# Altium schematic sheet FINAL.SchDoc
size A2
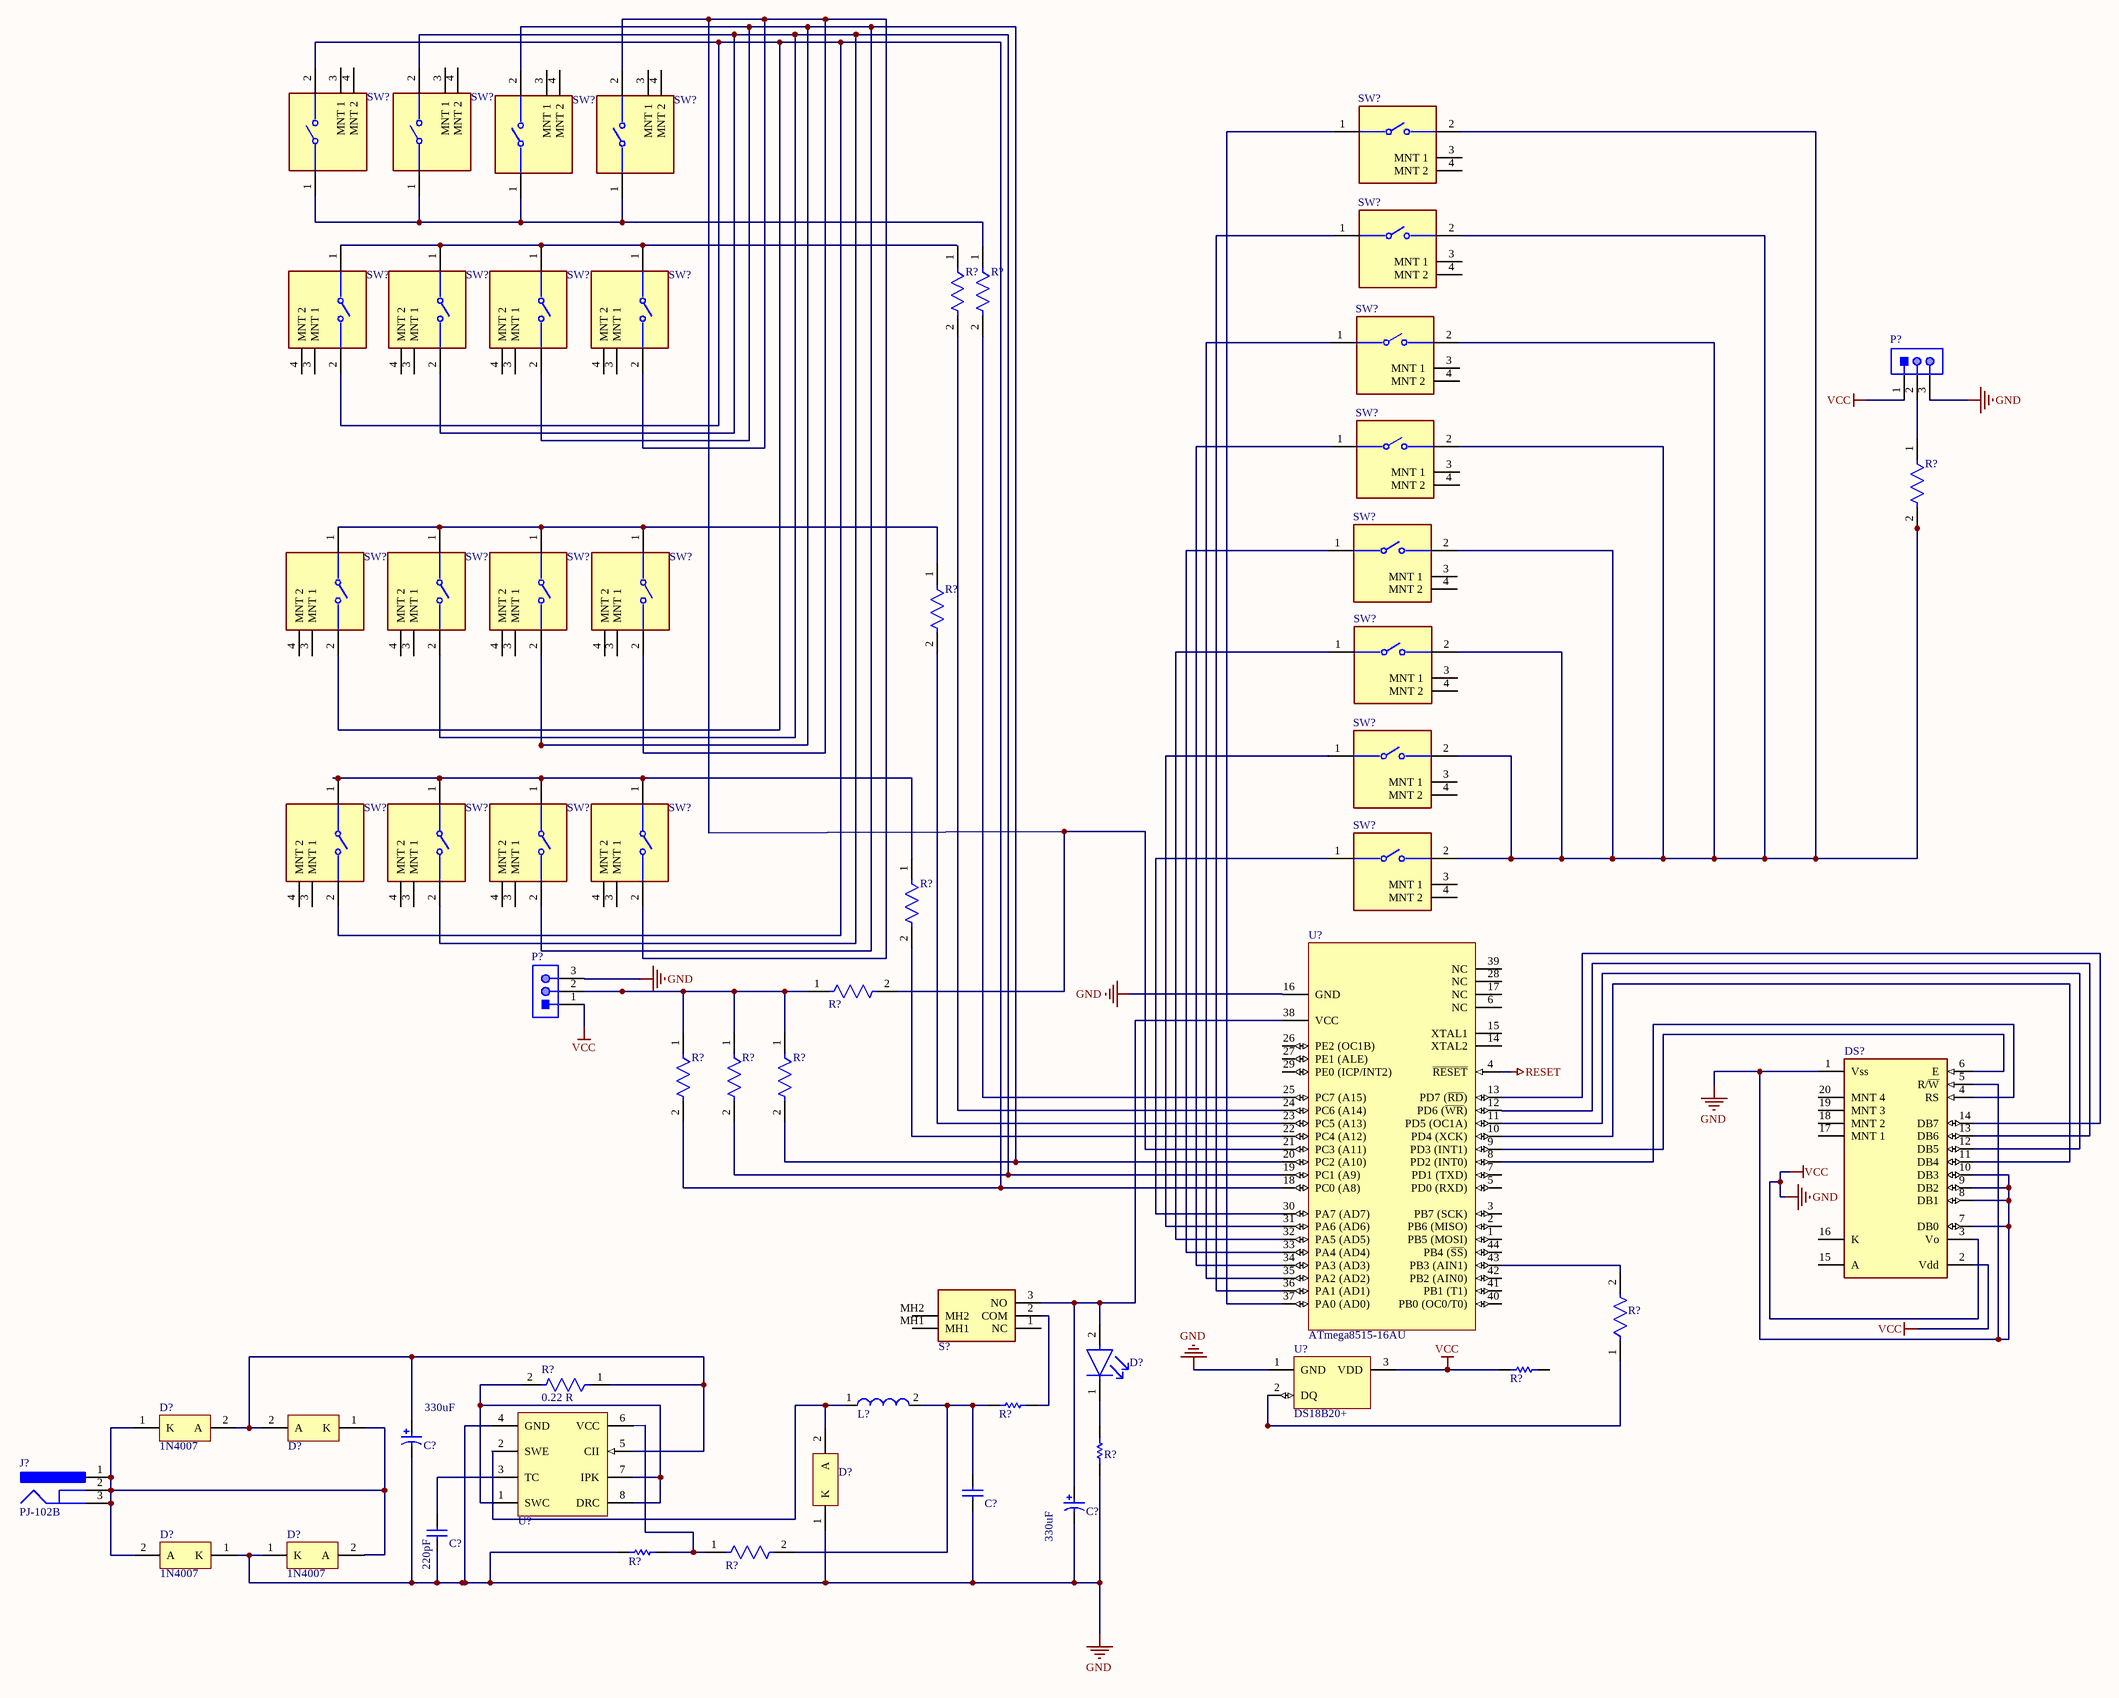
[diagram p0: FINAL.SchDoc]

## Parts
(Parts that share a designator on the sheet are numbered #1, #2 ... from top to bottom, then left to right.)
C?#1  EEE-FK1V331P  [PNSC-EEE-FK1V331P_L]  (value not drawn)
C?#2  EEE-FK1V331P  [PNSC-EEE-FK1V331P_L]  (value not drawn)
C?#3  GRM188R60J106ME47D  [CAPC1608X90X35NL10T15]  (value not drawn)
C?#4  VJ0603D201KXAAJ  [CAPC1608X92X38LL15T08]  (value not drawn)
D?#1  LTST-C190GKT  [FP-LTST-C190GKT-MFG]  (value not drawn)
D?#2  1N4007  [ONSC-AXIAL_LEAD-2-59-10_P]  (value not drawn)
D?#3  1N4007  [ONSC-AXIAL_LEAD-2-59-10_P]
D?#4  MBRS140T3G  [ONSC-SMB-2-403A-03_H_V]  (value not drawn)
D?#5  1N4007  [ONSC-AXIAL_LEAD-2-59-10_P]
D?#6  1N4007  [ONSC-AXIAL_LEAD-2-59-10_P]
DS?  WH1604A-YYH-JT#  [FP-WH1604A-YYH-JT#-MFG]  (value not drawn)
J?  PJ-102B  [CUI-PJ-102B_V]
L?  744774222  [WE-PD2-M]  (value not drawn)
P?#1  691701350003B  [691701350003B]  (value not drawn)
P?#2  691701350003B  [691701350003B]  (value not drawn)
R?#1  CRCW06031K00FKEAHP  [FP-CRCW0603-HPe3-MFG]  (value not drawn)
R?#2  CRCW06031K00FKEAHP  [FP-CRCW0603-HPe3-MFG]  (value not drawn)
R?#3  CRCW06031K00FKEAHP  [FP-CRCW0603-HPe3-MFG]  (value not drawn)
R?#4  CRCW06031K00FKEAHP  [FP-CRCW0603-HPe3-MFG]  (value not drawn)
R?#5  CRCW06031K00FKEAHP  [FP-CRCW0603-HPe3-MFG]  (value not drawn)
R?#6  CRCW06031K00FKEAHP  [FP-CRCW0603-HPe3-MFG]  (value not drawn)
R?#7  CRCW06031K00FKEAHP  [FP-CRCW0603-HPe3-MFG]  (value not drawn)
R?#8  CRCW06031K00FKEAHP  [FP-CRCW0603-HPe3-MFG]  (value not drawn)
R?#9  CRCW06031K00FKEAHP  [FP-CRCW0603-HPe3-MFG]  (value not drawn)
R?#10  CRCW08051K00FKEA  [RESC2013X50X30NL20T20]  (value not drawn)
R?#11  CRCW08050000Z0EAHP  [FP-CRCW0805-HPe3-IPC_A]  (value not drawn)
R?#12  Resistance: 0.22 R  [FP-CRCW0402-e3-IPC_C]  (hidden comment: CRCW04022K70FKED)
R?#13  Jumper 2512(6432)  [RESC2512(6432)_L]  (value not drawn)
R?#14  RC0402FR-072K2L  [RESC1005X40X25NL05T10]  (value not drawn)
R?#15  CRCW08051K00FKEA  [RESC2013X50X30NL20T20]  (value not drawn)
R?#16  CRCW06033K00FKEA  [FP-CRCW0603-e3-MFG]  (value not drawn)
S?  MS12ASW40  [MS12ASW40]  (value not drawn)
SW?#1  1825027-5  [FP-1825027-5-0]  (value not drawn)
SW?#2  1825027-5  [FP-1825027-5-0]  (value not drawn)
SW?#3  1825027-5  [FP-1825027-5-0]  (value not drawn)
SW?#4  1825027-5  [FP-1825027-5-0]  (value not drawn)
SW?#5  1825027-5  [FP-1825027-5-0]  (value not drawn)
SW?#6  1825027-5  [FP-1825027-5-0]  (value not drawn)
SW?#7  1825027-5  [FP-1825027-5-0]  (value not drawn)
SW?#8  1825027-5  [FP-1825027-5-0]  (value not drawn)
SW?#9  1825027-5  [FP-1825027-5-0]  (value not drawn)
SW?#10  1825027-5  [FP-1825027-5-0]  (value not drawn)
SW?#11  1825027-5  [FP-1825027-5-0]  (value not drawn)
SW?#12  1825027-5  [FP-1825027-5-0]  (value not drawn)
SW?#13  1825027-5  [FP-1825027-5-0]  (value not drawn)
SW?#14  1825027-5  [FP-1825027-5-0]  (value not drawn)
SW?#15  1825027-5  [FP-1825027-5-0]  (value not drawn)
SW?#16  1825027-5  [FP-1825027-5-0]  (value not drawn)
SW?#17  1825027-5  [FP-1825027-5-0]  (value not drawn)
SW?#18  1825027-5  [FP-1825027-5-0]  (value not drawn)
SW?#19  1825027-5  [FP-1825027-5-0]  (value not drawn)
SW?#20  1825027-5  [FP-1825027-5-0]  (value not drawn)
SW?#21  1825027-5  [FP-1825027-5-0]  (value not drawn)
SW?#22  1825027-5  [FP-1825027-5-0]  (value not drawn)
SW?#23  1825027-5  [FP-1825027-5-0]  (value not drawn)
SW?#24  1825027-5  [FP-1825027-5-0]  (value not drawn)
U?#1  ATmega8515-16AU  [44A_N]
U?#2  DS18B20+  [Q3+1]
U?#3  MC34063ACD-TR  [SO8_M]  (value not drawn)

## Nets
GND: C?#1.2 C?#2.2 C?#3.1 C?#4.1 D?#4.1(K) D?#5.1(K) D?#6.1(K) DS?.1(Vss) DS?.2(Vdd) DS?.3(Vo) DS?.5(R/~{W}) DS?.7(DB0) DS?.8(DB1) DS?.9(DB2) DS?.10(DB3) P?#1.1 P?#1.3 P?#2.1 P?#2.3 R?#10.1 R?#14.2 R?#15.1 U?#1.16(GND) U?#2.1(GND) U?#2.3(VDD) U?#3.4(GND)  [also labelled VCC]
RESET: U?#1.4(~{RESET})
NetC?#1_1: C?#1.1 D?#2.2(A) D?#3.2(A) R?#12.1 U?#3.5(CII)
NetC?#2_1: C?#2.1 D?#1.2(A) S?.3(NO) U?#1.38(VCC)
NetC?#3_2: C?#3.2 L?.2 R?#13.1 R?#16.2
NetC?#4_2: C?#4.2 U?#3.3(TC)
NetD?#1_1: D?#1.1(C) R?#14.1
NetD?#2_1: D?#2.1(K) D?#3.1(K) D?#5.2(A) J?.1 J?.2 J?.3
NetD?#4_2: D?#4.2(A) L?.1 U?#3.2(SWE)
NetDS?_4: DS?.4(RS) U?#1.8(PD2_(INT0))
NetDS?_6: DS?.6(E) U?#1.9(PD3_(INT1))
NetDS?_11: DS?.11(DB4) U?#1.10(PD4_(XCK))
NetDS?_12: DS?.12(DB5) U?#1.11(PD5_(OC1A))
NetDS?_13: DS?.13(DB6) U?#1.12(PD6_(~{WR}))
NetDS?_14: DS?.14(DB7) U?#1.13(PD7_(~{RD}))
NetP?#1_2: P?#1.2 R?#3.1
NetP?#2_2: P?#2.2 R?#6.1 R?#7.1 R?#8.1 R?#9.1
NetR?#1_1: R?#1.1 SW?#7.1 SW?#8.1 SW?#9.1 SW?#10.1
NetR?#1_2: R?#1.2 U?#1.24(PC6_(A14))
NetR?#2_1: R?#2.1 SW?#2.1 SW?#3.1 SW?#4.1 SW?#5.1
NetR?#2_2: R?#2.2 U?#1.25(PC7_(A15))
NetR?#3_2: R?#3.2 SW?#1.2 SW?#6.2 SW?#11.2 SW?#12.2 SW?#17.2 SW?#18.2 SW?#19.2 SW?#24.2
NetR?#4_1: R?#4.1 SW?#13.1 SW?#14.1 SW?#15.1 SW?#16.1
NetR?#4_2: R?#4.2 U?#1.23(PC5_(A13))
NetR?#5_1: R?#5.1 SW?#20.1 SW?#21.1 SW?#22.1 SW?#23.1
NetR?#5_2: R?#5.2 U?#1.22(PC4_(A12))
NetR?#6_2: R?#6.2 SW?#5.2 SW?#10.2 SW?#16.2 SW?#23.2 U?#1.21(PC3_(A11))
NetR?#7_2: R?#7.2 SW?#2.2 SW?#7.2 SW?#13.2 SW?#20.2 U?#1.18(PC0_(A8))
NetR?#8_2: R?#8.2 SW?#3.2 SW?#8.2 SW?#14.2 SW?#21.2 U?#1.19(PC1_(A9))
NetR?#9_2: R?#9.2 SW?#4.2 SW?#9.2 SW?#15.2 SW?#22.2 U?#1.20(PC2_(A10))
NetR?#11_1: R?#11.1 U?#2.2(DQ)
NetR?#11_2: R?#11.2 U?#1.43(PB3_(AIN1))
NetR?#12_2: R?#12.2 U?#3.1(SWC) U?#3.7(IPK) U?#3.8(DRC)
NetR?#13_2: R?#13.2 S?.2(COM)
NetR?#15_2: R?#15.2 R?#16.1 U?#3.6(VCC)
NetSW?#1_1: SW?#1.1 U?#1.37(PA0_(AD0))
NetSW?#6_1: SW?#6.1 U?#1.36(PA1_(AD1))
NetSW?#11_1: SW?#11.1 U?#1.35(PA2_(AD2))
NetSW?#12_1: SW?#12.1 U?#1.34(PA3_(AD3))
NetSW?#17_1: SW?#17.1 U?#1.33(PA4_(AD4))
NetSW?#18_1: SW?#18.1 U?#1.32(PA5_(AD5))
NetSW?#19_1: SW?#19.1 U?#1.31(PA6_(AD6))
NetSW?#24_1: SW?#24.1 U?#1.30(PA7_(AD7))

Not connected (* = marked no-connect by the designer): D?#6 2(A); DS? 15(A) 16(K) 17(MNT_1) 18(MNT_2) 19(MNT_3) 20(MNT_4); R?#10 2; S? 1(NC) MH1 MH2; SW?#1 3(MNT_1) 4(MNT_2); SW?#2 3(MNT_1) 4(MNT_2); SW?#3 3(MNT_1) 4(MNT_2); SW?#4 3(MNT_1) 4(MNT_2); SW?#5 3(MNT_1) 4(MNT_2); SW?#6 3(MNT_1) 4(MNT_2); SW?#7 3(MNT_1) 4(MNT_2); SW?#8 3(MNT_1) 4(MNT_2); SW?#9 3(MNT_1) 4(MNT_2); SW?#10 3(MNT_1) 4(MNT_2); SW?#11 3(MNT_1) 4(MNT_2); SW?#12 3(MNT_1) 4(MNT_2); SW?#13 3(MNT_1) 4(MNT_2); SW?#14 3(MNT_1) 4(MNT_2); SW?#15 3(MNT_1) 4(MNT_2); SW?#16 3(MNT_1) 4(MNT_2); SW?#17 3(MNT_1) 4(MNT_2); SW?#18 3(MNT_1) 4(MNT_2); SW?#19 3(MNT_1) 4(MNT_2); SW?#20 3(MNT_1) 4(MNT_2); SW?#21 3(MNT_1) 4(MNT_2); SW?#22 3(MNT_1) 4(MNT_2); SW?#23 3(MNT_1) 4(MNT_2); SW?#24 3(MNT_1) 4(MNT_2); U?#1 1(PB5_(MOSI)) 2(PB6_(MISO)) 3(PB7_(SCK)) 5(PD0_(RXD)) 6(NC) 7(PD1_(TXD)) 14(XTAL2) 15(XTAL1) 17(NC) 26(PE2_(OC1B)) 27(PE1_(ALE)) 28(NC) 29(PE0_(ICP/INT2)) 39(NC) 40(PB0_(OC0/T0)) 41(PB1_(T1)) 42(PB2_(AIN0)) 44(PB4_(~{SS}))

## Notes on the sheet
- (near C?#1) 330uF
- (near C?#2) 330uF
- (near C?#4) 220pF

## Library data of the parts
C?#1 C?#2 = CMP-2000-06212-1: Aluminum Electrolytic Capacitor, 330 uF, 35 V, -55 to 105 degC, 2-Pin CAPAE, RoHS, Tape and Reel; Manufacturer: Panasonic; Capacitance: 330µF; Type: Can; Impedance: 0.08O; Ripple Current: 850mA; Lifetime@Temperature: 2000Hrs@105°C; Rated Voltage: 35V; Datasheet Version: 07/2008; Manufacturer URL: http://www.panasonic.com/; Package Description: 2-Pin Capacitor Aluminum Electrolytic, Body 10.3 x 10.3 mm, Height 10.5 mm; Case Size/Dimension: Ø10x10.2mm; Datasheet URL: https://datasheet.ciiva.com/29313/443481-da-01-en-smd-elko-vfk-g-330-uf-35v-29313592.pdf; Series: FK; Mounting Technology: SurfaceMount; Package Reference: EEE-FK1V331P; Operating Temp-Max: 105°C; Operating Temp Range: -55to+105°C
C?#3 = CMP-2006-02792-1: Manufacturer: Murata; Part Number: GRM188R60J106ME47D
C?#4 = CMP-2006-01502-1: Manufacturer: Vitramon; Part Number: VJ0603D201KXAAJ
D?#1 = CMP-22017-000005-2: LED GREEN CLEAR CHIP SMD; Dominant Wavelength: 569nm; Reverse Voltage: 5V; Lens Color: Colorless; Viewing Angle: 130°; Voltage: 2V; Forward Current: 30mA; Power Dissipation: 100mW; Luminous Intensity: 6mcd; Number of LEDs: 1; Forward Voltage: 2.1V; Wavelength: 565nm; Test Current: 10mA; Min Operating Temperature: -55°C; Lens Style: Clear; Mount: Surface Mount; Width: 0.8mm; Packaging: Tape and Reel; Lens Transparency: Clear; Case Code (Metric): 1608; Depth: 0.8mm; Case Code (Imperial): 0603; Case/Package: 0603; Number of Pins: 2; Max Operating Temperature: 85°C; Lead Free: Lead Free; Number of Elements: 1; Length: 1.6mm; Height: 0.8mm; Package Quantity: 1; Power Rating: 100mW; Radiation Hardening: No; Illumination Color: Green; Color: Green
D?#2 D?#3 D?#5 D?#6 = CMP-0902-00142-1: Standard Recovery Rectifier, 2-Pin Axial_Lead, Pb-Free, Bulk Bag; Manufacturer: On Semiconductor; IO(rec) Max (A): 1; IFSM Max (A): 30; VRRM Max (V): 1000; ComponentLink3URL: http://www.onsemi.cn/pub_link/Collateral/59-10.PDF; PackageVersion: Rev. U, 02/2005; PackageDescription: 2-Pin, Axial Lead, Diameter 2.35 mm; PackageReference: AXIAL_LEAD-2-59-10; RoHS: TRUE; PartNumber: 1N4007; Packing: Bulk Bag; DatasheetVersion: Rev. 13; ComponentLink3Description: Package Specification; ComponentLink1Description: Manufacturer URL; ComponentLink2URL: http://www.onsemi.com/pub_link/Collateral/1N4001-D.PDF; ComponentLink1URL: http://www.onsemi.com/; Type: Standard Recovery; ComponentLink2Description: Datasheet; Mounting Technology: Through Hole
D?#4 = CMP-1055-00347-1: Schottky Power Rectifier, 2-Pin SMB, Pb-Free, Tape and Reel; Manufacturer: On Semiconductor; Configuration: Single; IFSM Max (A): 40; PackageDescription: 2-Pin Small Molded Package, J-Bend Lead, Body 4.33 x 3.625 mm; PartNumber: MBRS140T3G; PackageReference: SMB-2-403A-03_H; ComponentLink1URL: http://www.onsemi.com/; ComponentLink2URL: http://www.onsemi.cn/pub_link/Collateral/MBRS140T3-D.PDF; PackageVersion: Rev. H, 05/2011; ComponentLink3URL: http://www.onsemi.com/pub_link/Collateral/1SMB5913BT3-D.PDF; Packing: Tape and Reel; ComponentLink1Description: Manufacturer URL; DatasheetVersion: Rev. 9; Mounting Technology: Surface Mount; RoHS: TRUE; ComponentLink3Description: Package Specification; ComponentLink2Description: Datasheet
DS? = CMP-249946-000001-1: Winstar WH1604A-YYH-JT 16x4 LCD Display Yellow/green LED Backlight; Max Supply Voltage: 5.5V; Forward Voltage: 4.2V; Min Supply Voltage: 4.5V; Wavelength: 575nm; Number Of Characters: 64; Colour: Green; Viewing Angle: 80/60°; Display Type: DOT Matrix; Interface: Parallel; Luminous Intensity: 150000mcd; Forward Current: 220mA; RoHS: TRUE; Manufacturer Part Number: WH1604A-YYH-JT#; Device Class L3: LCD; Manufacturer: Winstar; ComponentLink2URL: https://static.rapidonline.com/pdf/57-2240.pdf; Device Class L2: Displays; Height: 13.6mm; Device Class L1: Optoelectronics; Package: 0; Temperature Range High: +70°C; Temperature: -20°C to +70°C; Lead Free: Yes; ComponentLink2Description: Datasheet; Octopart: https://octopart.com/wh1604a-yyh-jt%23-winstar-55771695; Category: Disp; Temperature Range Low: -20°C; Automotive: No
J? = CMP-2000-06900-1: Through Hole Right Angle DC Power Jack, 2.5 A, 2.5 mm Center Pin, 3 Position, -25 to 85 degC, RoHS, Bulk; Manufacturer: CUIInc.; Insulation Resistance: 100MOhms; Inside Contact Diameter: 2.5mm; Outside Contact Diameter: 6.5mm; Voltage Rating: 24V; Current Rating: 2.5A; Brand: CUI; Datasheet URL: http://www.cui.com/product/resource/pj-102b.pdf; Housing Material: PolybutyleneTerephthalate(PBT); Operating Temperature Range: -25Cto+85C; Package Reference: PJ-102B; Factory Pack Quantity: 280; RoHS: True; Contact Material: Copper; Datasheet Version: Rev. 1.03, 04/2016; Product: Jacks; Mounting Angle: Right; Mounting Style: ThroughHole; Flammability Rating: UL94V-0; Product Category: DCPowerConnectors; Contact Gender: Male; Termination Style: ThroughHole; Manufacturer URL: http://www.cui.com/; Mounting Technology: ThroughHole; Package Description: 3-Pin Through Hole Device, Body 14.4 x 9 mm, Height 11 mm; Contact Plating: Nickel; Packaging: Bulk; Connector Type: DCPowerJack
L? = CMP-0227-00435-1: SMD Power Inductor WE-PD2, L = 220 µH; Inductance: 220 ÂµH; ComponentLink1URL: http://www.we-online.com; ComponentLink1Description: Manufacturer Link; ComponentLink2Description: Datasheet; PackageReference: WE-PD2-M; ComponentLink2URL: http://www.we-online.de/katalog/media/pdf/744774222.pdf; PackageDescription: SMD Inductor, 2-Leads, Body 5.8 x 5.2 mm; DatasheetVersion: ver 2, Jun-2005; PackageVersion: 2005
P?#1 P?#2 = CMP-1502-02015-1: Serie 7013 B - 3.81mm Horizontal PCB Header THR Type with Flanges WR-TBL, 3 pin; Manufacturer: Wurth Elektronik; Gender: Male; Pin Number: 3; Part Number: 691701350003B; Manufacturer URL: http://www.we-online.de; Package Reference: 691701350003B; Mounting Technology: SMT; Datasheet URL: http://katalog.we-online.de/em/datasheet/6917013500xxB.pdf; Pitch: 3.81mm; Publisher: WurthElektronik; Packaging: TapeandReel; Operating Temperature: -40to105degC
R?#1-R?#9 = CMP-2000-02970-2: RES Thick Film, 1kΩ, 1%, 0.33W, 100ppm/°C, 0603; Max Power Dissipation: 250mW; Voltage Rating (DC): 75V; Resistance: 1kR; Number of Terminations: 2; Min Operating Temperature: -55°C; Contact Plating: Tin; Termination: SMD/SMT; Weight: 7.1E-05oz; Height: 0.45mm; Radiation Hardening: No; Package Quantity: 10; Case Code (Imperial): 0603; Packaging: Tape and Reel; Max Operating Temperature: 155°C; Case/Package: 0603; Lead Free: Lead Free; Military Standard: Not; Mount: Surface Mount; Power Rating: 250mW; Length: 1.6mm; Features: Automotive AEC-Q200; Number of Pins: 2; Voltage Rating: 75V; Temperature Coefficient: 100ppm/°C; Depth: 0.85mm; Tolerance: 1%; Composition: Thick Film; Width: 0.8mm; Case Code (Metric): 1608
R?#10 R?#15 = CMP-1013-00510-2: Manufacturer: Vishay Dale; Part Number: CRCW08051K00FKEA
R?#11 = CMP-2001-04185-2: RES Thick Film, 0Ω, 0.5W, 0805; Resistance: 0mR; Max Power Dissipation: 500mW; Power Rating: 330mW; Voltage Rating (DC): 150V; Temperature Coefficient: 0ppm/°C; Tolerance: 5%; Min Operating Temperature: -55°C; Features: Automotive AEC-Q200; Weight: 0.000194oz; Case Code (Metric): 2012; Package Quantity: 5000; Packaging: Tape and Reel; Height: 0.024inch; Composition: Thick Film; Case Code (Imperial): 0805; Military Standard: Not; Number of Pins: 2; Termination: Solder; Lead Free: Lead Free; Max Operating Temperature: 155°C; Radiation Hardening: No; Voltage Rating: 150V; Width: 0.049inch; Number of Terminations: 2; Contact Plating: Tin; Length: 2mm; Depth: 1.25mm; Case/Package: 0805; REACH SVHC: No SVHC; Mount: Surface Mount
R?#12 = CMP-2002-08466-2: RES Thick Film, 0.22 Ω, 1%, 0.063W, 100ppm/°C, 0402; Power Rating: 63mW; Voltage Rating (DC): 50V; Termination: SMD/SMT; Composition: Thick Film; Packaging: Tape and Reel; Tolerance: 1%; Number of Pins: 2; Contact Plating: Tin; Max Operating Temperature: 155°C; Depth: 0.5mm; Features: Automotive AEC-Q200; Lead Free: Lead Free; Number of Terminations: 2; Case/Package: 0402; Max Power Dissipation: 63mW; Radiation Hardening: No; Height: 0.35mm; Min Operating Temperature: -55°C; Width: 0.02inch; Military Standard: Not; Package Quantity: 10; Weight: 2.3E-05oz; Temperature Coefficient: 100ppm/°C; Case Code (Metric): 1005; Voltage Rating: 50V; Length: 1mm; Case Code (Imperial): 0402
R?#13 = CMP-1018-00001-1: Jumper 2512 (6432 Metric); Tolerance: None; Case-EIA: 2512; Value: 0.00 Ohm; Case-Metric: 6432; Technology: SMT; Power: None
R?#14 = CMP-2002-07567-1: Manufacturer: Yageo / Phycomp; Part Number: RC0402FR-072K2L
R?#16 = CMP-2000-03293-2: RES Thick Film, 3kΩ, 1%, 0.1W, 100ppm/°C, 0603; Voltage Rating: 75V; Resistance: 3kR; Power Rating: 100mW; Features: Automotive AEC-Q200; Radiation Hardening: No; Contact Plating: Tin; Termination: SMD/SMT; Lead Free: Lead Free; Case Code (Imperial): 0603; Case Code (Metric): 1608; Case/Package: 0603; Depth: 0.85mm; Mount: Surface Mount; Voltage Rating (DC): 75V; Tolerance: 1%; Package Quantity: 10; Temperature Coefficient: 100ppm/°C; Height: 0.45mm; Max Power Dissipation: 100mW; Composition: Thick Film; Max Operating Temperature: 155°C; Military Standard: Not; Weight: 7.1E-05oz; Length: 1.55mm; Packaging: Tape and Reel; Number of Terminations: 2; Width: 0.85mm; Min Operating Temperature: -55°C
S? = MS12ASW40: Switch; Manufacturer_Name: NKK Switches; Datasheet Link: https://www.nkkswitches.de/products/Slides/Slides%20MS/MS12ASW40/; Height: 12.7mm; Manufacturer_Part_Number: MS12ASW40; Arrow Part Number: MS12ASW40; Arrow Price/Stock: https://www.arrow.com/en/products/ms12asw40/nkk-switches; Mouser Part Number: 633-MS12ASW40; Mouser Price/Stock: https://www.mouser.com/Search/Refine.aspx?Keyword=633-MS12ASW40
SW?#1-SW?#24 = CMP-2000-05514-2: SWITCH TACTILE SPST-NO 0.05A 24V; Manufacturer: TE Connectivity; Contact Current Rating: 50mA; Contact Resistance: 100mΩ; Electromechanical Life: 100000Cycles; Operating Force: 160gf; Throw Configuration: SPST-NO; Lead Free: Yes; Digikey Description: SWITCH TACTILE SPST-NO 0.05A 24V; ComponentLink2Description: Datasheet; Height: 7.31mm; ComponentLink2URL: https://www.te.com/commerce/DocumentDelivery/DDEController?Action=showdoc&DocId=Customer+Drawing%7F1825027%7FG4%7Fpdf%7FEnglish%7FENG_CD_1825027_G4.pdf%7F1825027-5; Mount: Through Hole; Temperature Range High: +85°C; Temperature: -35°C to +85°C; RoHS: TRUE; Device Class L3: Pushbutton Switches; Package: 1825027-5; Temperature Range Low: -35°C; Category: Switch; Automotive: No; Octopart: https://octopart.com/1825027-5-te+connectivity-46510878; Mouser Description: Tactile Switches R/A TACT 160G PB SWITCH; Manufacturer Part Number: 1825027-5; Voltage Rating Dc: 24V; Device Class L2: Switches; Device Class L1: Electromechanical
U?#1 = CMP-0095-00300-3: 8-bit AVR Microcontroller, 8KB Flash, 512 Bytes EEPROM, 512 Bytes SRAM, 4.5-5.5V, 44-pin TQFP, Industrial Grade (-40°C to 85°C); ComponentLink2URL: http://www.atmel.com/dyn/resources/prod_documents/doc2512.pdf; PackageReference: 44A; DatasheetVersion: revK, Jan-2010; ComponentLink1URL: http://www.atmel.com/; PackageDescription: 44-Pin Plastic Thin Profile Quad Flat Pack, 10 x 10 x 1.0 mm Body, 0.8 mm Pitch (TQFP); Code_JEDEC: MS-026-ACB; RevisionNote: Re-linked to correct symbol; PackageVersion: revC, Oct-2010; ComponentLink3URL: http://www.atmel.com/dyn/resources/prod_documents/2512S.pdf; ComponentLink2Description: ATmega8515(L) Datasheet; ComponentLink3Description: ATmega8515(L) Summary; ComponentLink1Description: Manufacturer URL
U?#2 = CMP-0253-00003-1: Programmable Resolution Digital Thermometer, 1-Wire Interface, ±0.5°C Accuracy, 3-Pin TO92, -55°C to +125°C, Pb-Free; ComponentLink2URL: http://datasheets.maxim-ic.com/en/ds/DS18B20.pdf; PackageReference: Q3+1; ComponentLink1Description: Manufacturer URL; PackageDescription: TO-92 Package, Body Dia. 4.7mm; Leads 0.51 x 0.51 mm (max), Pb-Free; DatasheetVersion: 2007; Code_JEDEC: TO-226-AA; ComponentLink1URL: http://www.maxim-ic.com; PackageVersion: revB, 2009; ComponentLink2Description: Datasheet
U?#3 = CMP-0241-00016-1: DC/DC converter control circuit, 8-Pin SO, Tape and Reel; Code_IPC: SOIC127P600-8; ComponentLink2Description: Datasheet; ComponentLink3Description: Package Specification; PackageDescription: 8-Pin Small Outline Integrated Circuit 1.27 mm Pitch; Code_JEDEC: MS-012-AA; ComponentLink3URL: http://www.st.com/internet/com/TECHNICAL_RESOURCES/TECHNICAL_LITERATURE/PACKAGE_INFORMATION/CD00004680.pdf; ComponentLink1Description: Manufacturer URL; ComponentLink1URL: http://www.st.com; DatasheetVersion: Nov-2007; ComponentLink2URL: http://www.st.com/internet/com/TECHNICAL_RESOURCES/TECHNICAL_LITERATURE/DATASHEET/CD00001232.pdf; PackageReference: SO8; PackageVersion: Dec-2002